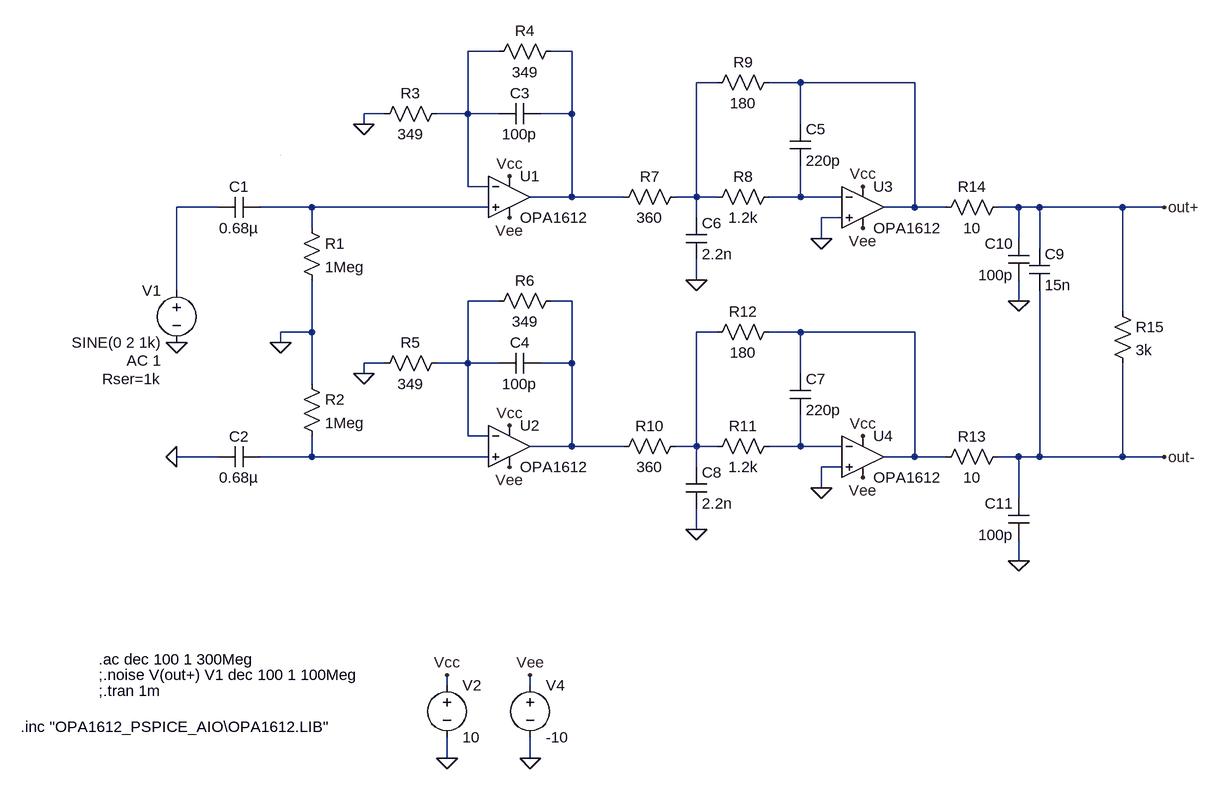
[diagram p0: schematic analog frontend OPA1612.asc]
analog frontend OPA1612.asc, the LTspice schematic file:
Version 4
SHEET 1 1788 948
WIRE 336 -160 288 -160
WIRE 448 -160 416 -160
WIRE 672 -112 640 -112
WIRE 800 -112 752 -112
WIRE 976 -112 800 -112
WIRE 160 -64 128 -64
WIRE 288 -64 288 -160
WIRE 288 -64 240 -64
WIRE 336 -64 288 -64
WIRE 448 -64 448 -160
WIRE 448 -64 400 -64
WIRE 128 -48 128 -64
WIRE 800 -48 800 -112
WIRE 288 48 288 -64
WIRE 320 48 288 48
WIRE 448 64 448 -64
WIRE 448 64 384 64
WIRE 528 64 448 64
WIRE 640 64 640 -112
WIRE 640 64 608 64
WIRE 672 64 640 64
WIRE 800 64 800 16
WIRE 800 64 752 64
WIRE 864 64 800 64
WIRE -96 80 -160 80
WIRE 48 80 -32 80
WIRE 320 80 48 80
WIRE 976 80 976 -112
WIRE 976 80 928 80
WIRE 1024 80 976 80
WIRE 1136 80 1104 80
WIRE 1168 80 1136 80
WIRE 1296 80 1168 80
WIRE 1360 80 1296 80
WIRE 640 96 640 64
WIRE 864 96 832 96
WIRE 48 112 48 80
WIRE 832 128 832 96
WIRE 1136 128 1136 80
WIRE 1168 144 1168 80
WIRE 640 192 640 160
WIRE -160 208 -160 80
WIRE 336 224 288 224
WIRE 448 224 416 224
WIRE 1136 224 1136 192
WIRE 1296 240 1296 80
WIRE 48 272 48 192
WIRE 48 272 0 272
WIRE 672 272 640 272
WIRE 800 272 752 272
WIRE 976 272 800 272
WIRE 0 288 0 272
WIRE 160 320 128 320
WIRE 288 320 288 224
WIRE 288 320 240 320
WIRE 336 320 288 320
WIRE 448 320 448 224
WIRE 448 320 400 320
WIRE 128 336 128 320
WIRE 800 336 800 272
WIRE 48 352 48 272
WIRE 288 432 288 320
WIRE 320 432 288 432
WIRE 448 448 448 320
WIRE 448 448 384 448
WIRE 528 448 448 448
WIRE 640 448 640 272
WIRE 640 448 608 448
WIRE 672 448 640 448
WIRE 800 448 800 400
WIRE 800 448 752 448
WIRE 864 448 800 448
WIRE -96 464 -160 464
WIRE 48 464 48 432
WIRE 48 464 -32 464
WIRE 320 464 48 464
WIRE 976 464 976 272
WIRE 976 464 928 464
WIRE 1024 464 976 464
WIRE 1136 464 1104 464
WIRE 1168 464 1168 208
WIRE 1168 464 1136 464
WIRE 1296 464 1296 320
WIRE 1296 464 1168 464
WIRE 1360 464 1296 464
WIRE 640 480 640 448
WIRE 864 480 832 480
WIRE 832 512 832 480
WIRE 1136 528 1136 464
WIRE 640 576 640 544
WIRE 1136 624 1136 592
WIRE 256 816 256 800
WIRE 384 816 384 800
WIRE 256 928 256 896
WIRE 384 928 384 896
WIRE 0 0 0 0
FLAG 256 928 0
FLAG 1360 80 out+
FLAG 256 800 Vcc
FLAG 384 928 0
FLAG 384 800 Vee
FLAG 352 32 Vcc
FLAG 352 96 Vee
FLAG 0 288 0
FLAG 352 416 Vcc
FLAG 352 480 Vee
FLAG 128 336 0
FLAG 128 -48 0
FLAG 640 192 0
FLAG 896 48 Vcc
FLAG 896 112 Vee
FLAG 1360 464 out-
FLAG 640 576 0
FLAG 896 432 Vcc
FLAG 896 496 Vee
FLAG 832 128 0
FLAG 832 512 0
FLAG -160 288 0
FLAG -160 464 0
FLAG 1136 224 0
FLAG 1136 624 0
SYMBOL voltage 256 800 R0
WINDOW 123 0 0 Left 2
WINDOW 39 0 0 Left 2
SYMATTR InstName V2
SYMATTR Value 10
SYMBOL voltage 384 800 R0
WINDOW 123 0 0 Left 2
WINDOW 39 0 0 Left 2
SYMATTR InstName V4
SYMATTR Value -10
SYMBOL voltage -160 192 M0
WINDOW 123 24 124 Left 2
WINDOW 39 24 152 Left 2
SYMATTR Value2 AC 1
SYMATTR SpiceLine Rser=1k
SYMATTR InstName V1
SYMATTR Value SINE(0 2 1k)
SYMBOL cap -32 64 R90
WINDOW 0 0 32 VBottom 2
WINDOW 3 32 32 VTop 2
SYMATTR InstName C1
SYMATTR Value 0.68µ
SYMBOL res 32 96 R0
SYMATTR InstName R1
SYMATTR Value 1Meg
SYMBOL res 32 336 R0
SYMATTR InstName R2
SYMATTR Value 1Meg
SYMBOL cap -32 448 R90
WINDOW 0 0 32 VBottom 2
WINDOW 3 32 32 VTop 2
SYMATTR InstName C2
SYMATTR Value 0.68µ
SYMBOL res 432 208 R90
WINDOW 0 0 56 VBottom 2
WINDOW 3 32 56 VTop 2
SYMATTR InstName R6
SYMATTR Value 349
SYMBOL res 432 -176 R90
WINDOW 0 0 56 VBottom 2
WINDOW 3 32 56 VTop 2
SYMATTR InstName R4
SYMATTR Value 349
SYMBOL res 256 -80 R90
WINDOW 0 0 56 VBottom 2
WINDOW 3 32 56 VTop 2
SYMATTR InstName R3
SYMATTR Value 349
SYMBOL res 256 304 R90
WINDOW 0 0 56 VBottom 2
WINDOW 3 32 56 VTop 2
SYMATTR InstName R5
SYMATTR Value 349
SYMBOL cap 400 -80 R90
WINDOW 0 0 32 VBottom 2
WINDOW 3 32 32 VTop 2
SYMATTR InstName C3
SYMATTR Value 100p
SYMBOL cap 400 304 R90
WINDOW 0 0 32 VBottom 2
WINDOW 3 32 32 VTop 2
SYMATTR InstName C4
SYMATTR Value 100p
SYMBOL cap 784 -48 R0
SYMATTR InstName C5
SYMATTR Value 220p
SYMBOL res 624 48 R90
WINDOW 0 0 56 VBottom 2
WINDOW 3 32 56 VTop 2
SYMATTR InstName R7
SYMATTR Value 360
SYMBOL res 768 48 R90
WINDOW 0 0 56 VBottom 2
WINDOW 3 32 56 VTop 2
SYMATTR InstName R8
SYMATTR Value 1.2k
SYMBOL res 768 -128 R90
WINDOW 0 0 56 VBottom 2
WINDOW 3 32 56 VTop 2
SYMATTR InstName R9
SYMATTR Value 180
SYMBOL cap 624 96 R0
SYMATTR InstName C6
SYMATTR Value 2.2n
SYMBOL cap 784 336 R0
SYMATTR InstName C7
SYMATTR Value 220p
SYMBOL res 624 432 R90
WINDOW 0 0 56 VBottom 2
WINDOW 3 32 56 VTop 2
SYMATTR InstName R10
SYMATTR Value 360
SYMBOL res 768 432 R90
WINDOW 0 0 56 VBottom 2
WINDOW 3 32 56 VTop 2
SYMATTR InstName R11
SYMATTR Value 1.2k
SYMBOL res 768 256 R90
WINDOW 0 0 56 VBottom 2
WINDOW 3 32 56 VTop 2
SYMATTR InstName R12
SYMATTR Value 180
SYMBOL cap 624 480 R0
SYMATTR InstName C8
SYMATTR Value 2.2n
SYMBOL res 1120 448 R90
WINDOW 0 0 56 VBottom 2
WINDOW 3 32 56 VTop 2
SYMATTR InstName R13
SYMATTR Value 10
SYMBOL res 1120 64 R90
WINDOW 0 0 56 VBottom 2
WINDOW 3 32 56 VTop 2
SYMATTR InstName R14
SYMATTR Value 10
SYMBOL Opamps\\opamp2 352 0 R0
SYMATTR InstName U1
SYMATTR Value OPA1612
SYMBOL Opamps\\opamp2 352 384 R0
SYMATTR InstName U2
SYMATTR Value OPA1612
SYMBOL Opamps\\opamp2 896 16 R0
SYMATTR InstName U3
SYMATTR Value OPA1612
SYMBOL Opamps\\opamp2 896 400 R0
SYMATTR InstName U4
SYMATTR Value OPA1612
SYMBOL cap 1152 144 R0
SYMATTR InstName C9
SYMATTR Value 15n
SYMBOL res 1280 224 R0
SYMATTR InstName R15
SYMATTR Value 3k
SYMBOL cap 1152 128 M0
SYMATTR InstName C10
SYMATTR Value 100p
SYMBOL cap 1152 528 M0
SYMATTR InstName C11
SYMATTR Value 100p
TEXT -280 776 Left 2 !.ac dec 100 1 300Meg
TEXT -280 800 Left 2 !;.noise V(out+) V1 dec 100 1 100Meg
TEXT -280 824 Left 2 !;.tran 1m
TEXT -400 880 Left 2 !.inc "OPA1612_PSPICE_AIO\\OPA1612.LIB"

The netlist it stands for:
* analog frontend OPA1612.asc
V2 Vcc 0 10
V4 Vee 0 -10
V1 N006 0 SINE(0 2 1k) AC 1 Rser=1k
C1 N007 N006 0.68µ
R1 N007 0 1Meg
R2 0 N013 1Meg
C2 N013 0 0.68µ
R6 N009 N008 349
R4 N002 N001 349
R3 N001 0 349
R5 N008 0 349
C3 N002 N001 100p
C4 N009 N008 100p
C5 N004 N005 220p
R7 N003 N002 360
R8 N005 N003 1.2k
R9 N004 N003 180
C6 N003 0 2.2n
C7 N011 N012 220p
R10 N010 N009 360
R11 N012 N010 1.2k
R12 N011 N010 180
C8 N010 0 2.2n
R13 out- N011 10
R14 out+ N004 10
XU1 N007 N001 Vcc Vee N002 OPA1612  ; pins In+ In- V+ V- OUT
XU2 N013 N008 Vcc Vee N009 OPA1612  ; pins In+ In- V+ V- OUT
XU3 0 N005 Vcc Vee N004 OPA1612  ; pins In+ In- V+ V- OUT
XU4 0 N012 Vcc Vee N011 OPA1612  ; pins In+ In- V+ V- OUT
C9 out+ out- 15n
R15 out+ out- 3k
C10 out+ 0 100p
C11 out- 0 100p
.ac dec 100 1 300Meg
;.noise V(out+) V1 dec 100 1 100Meg
;.tran 1m
.inc "OPA1612_PSPICE_AIO\OPA1612.LIB"
.backanno
.end